# Altium schematic sheet Filter3.SchDoc
size 420 x 297 mm; SheetNumber: 8; SheetTotal: 13
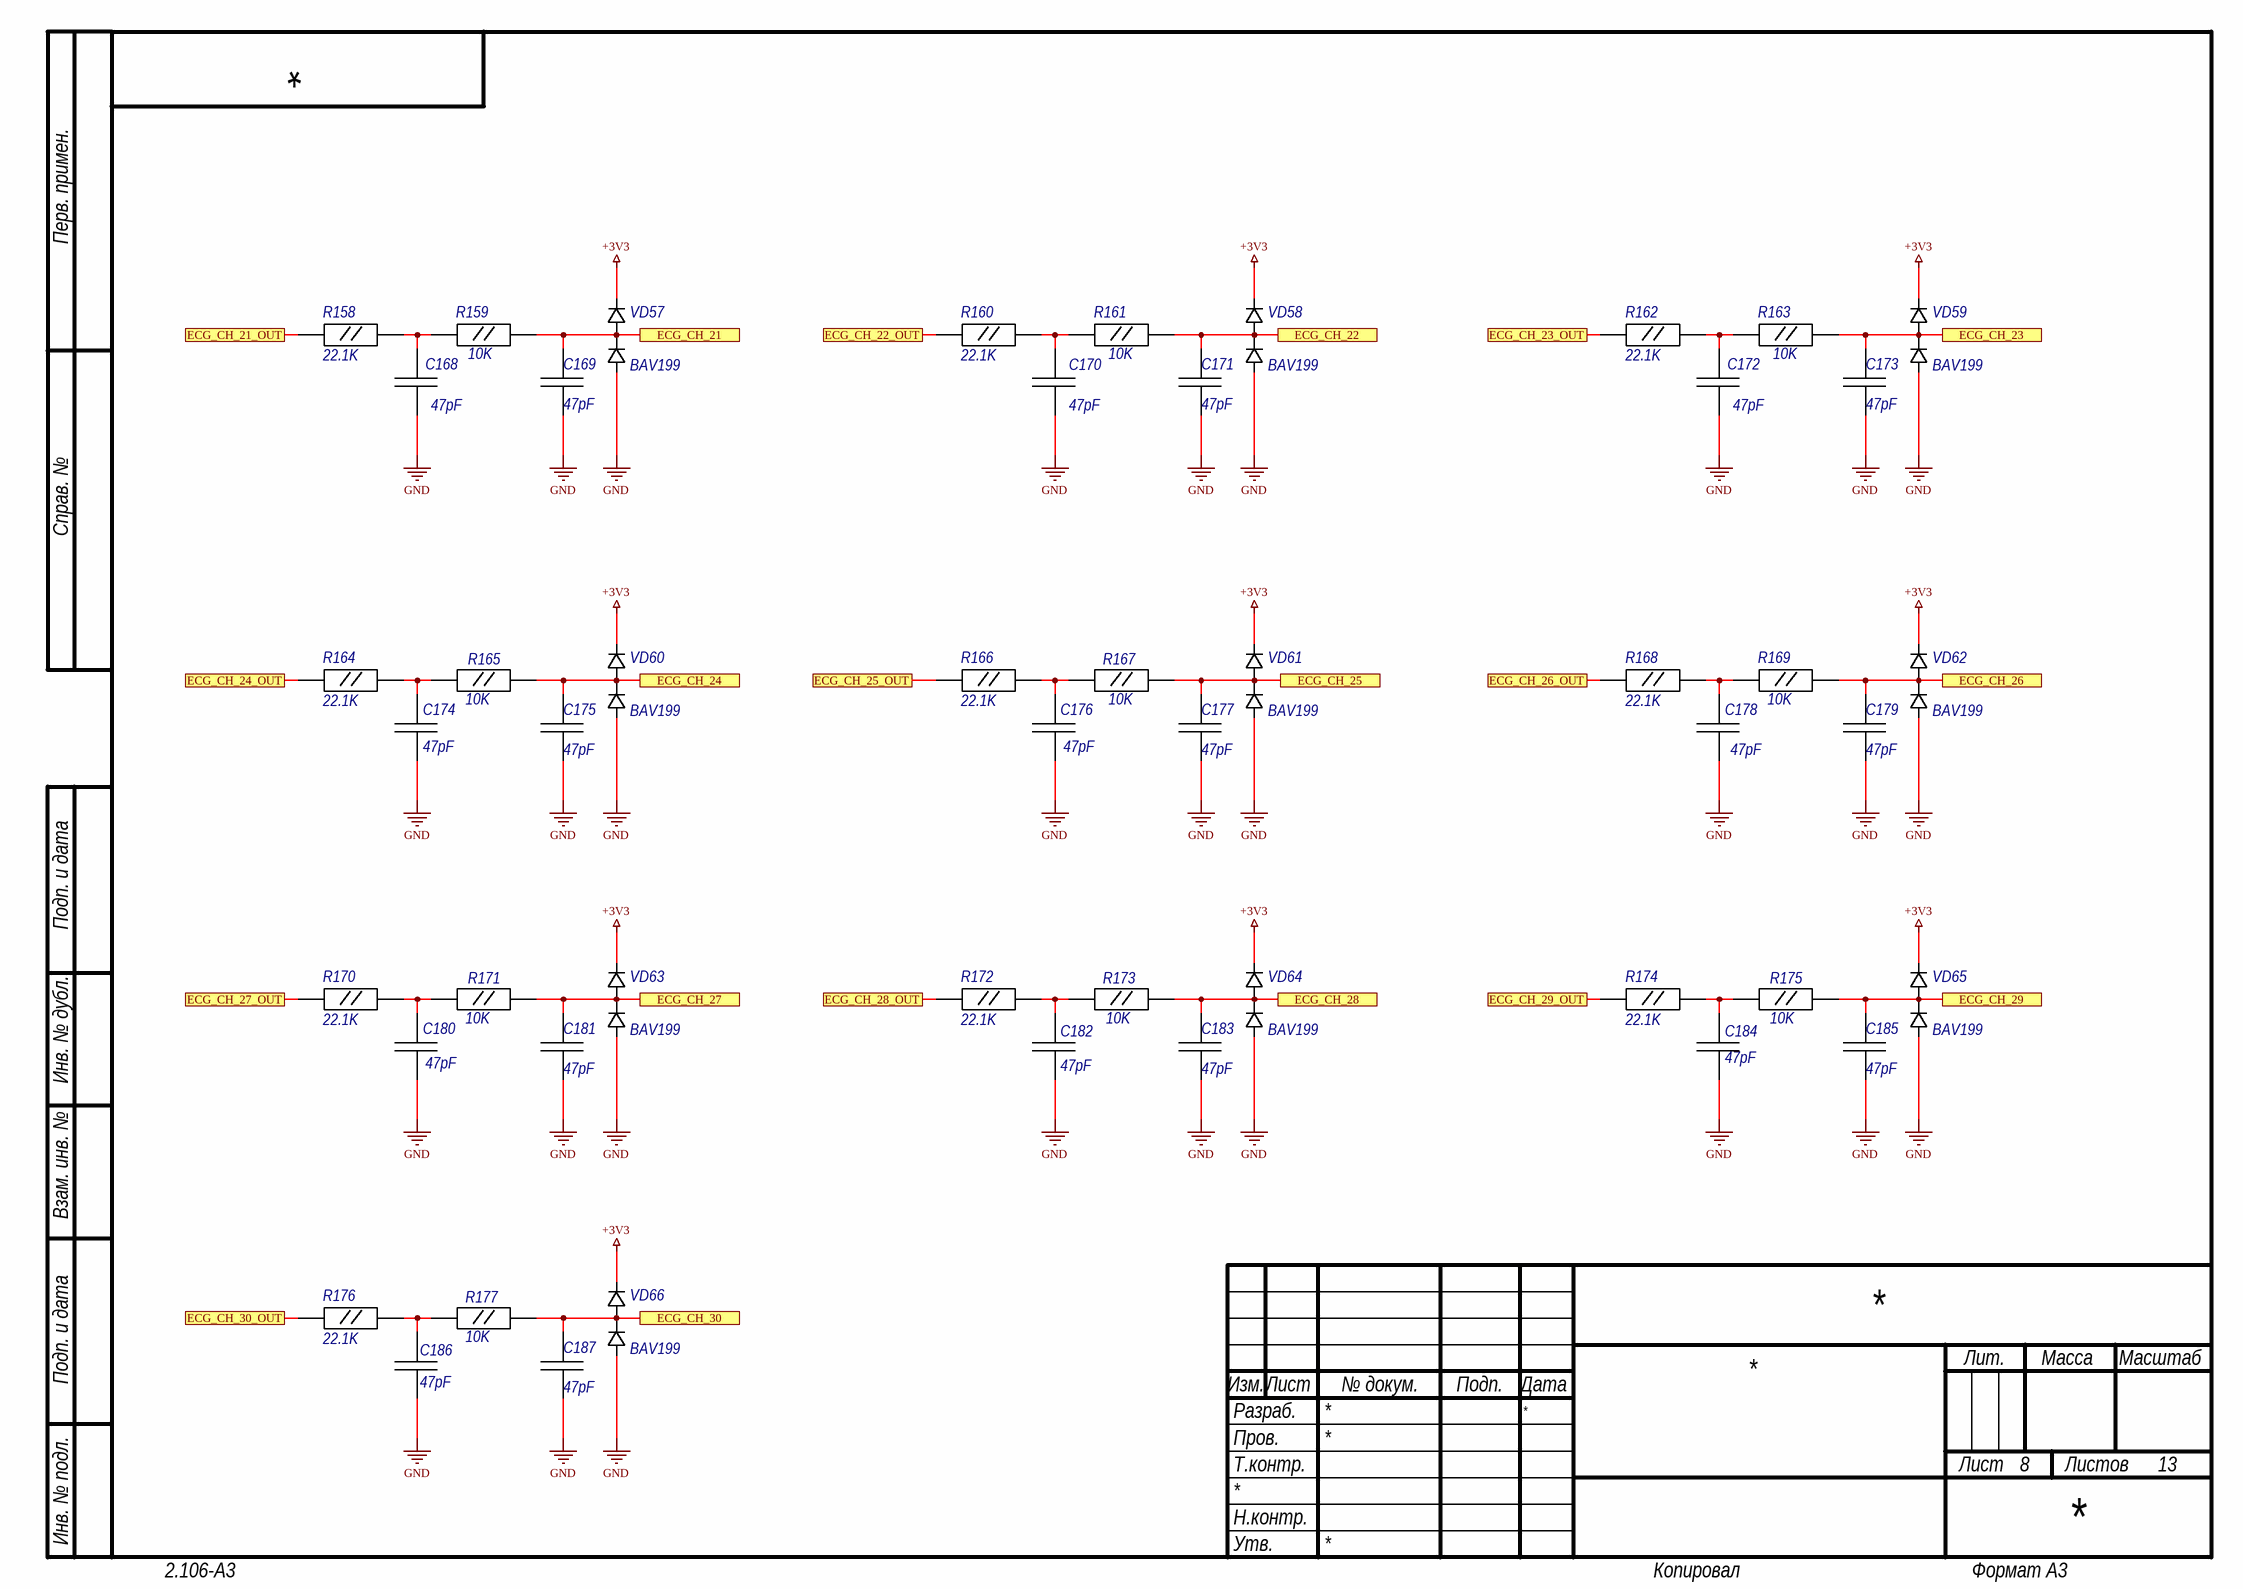
[diagram p0: Filter3.SchDoc]

## Parts
C168  47pF  [C0603]
C169  47pF  [C0603]
C170  47pF  [C0603]
C171  47pF  [C0603]
C172  47pF  [C0603]
C173  47pF  [C0603]
C174  47pF  [C0603]
C175  47pF  [C0603]
C176  47pF  [C0603]
C177  47pF  [C0603]
C178  47pF  [C0603]
C179  47pF  [C0603]
C180  47pF  [C0603]
C181  47pF  [C0603]
C182  47pF  [C0603]
C183  47pF  [C0603]
C184  47pF  [C0603]
C185  47pF  [C0603]
C186  47pF  [C0603]
C187  47pF  [C0603]
R158  22.1K  [R0603]
R159  10K  [R0603]
R160  22.1K  [R0603]
R161  10K  [R0603]
R162  22.1K  [R0603]
R163  10K  [R0603]
R164  22.1K  [R0603]
R165  10K  [R0603]
R166  22.1K  [R0603]
R167  10K  [R0603]
R168  22.1K  [R0603]
R169  10K  [R0603]
R170  22.1K  [R0603]
R171  10K  [R0603]
R172  22.1K  [R0603]
R173  10K  [R0603]
R174  22.1K  [R0603]
R175  10K  [R0603]
R176  22.1K  [R0603]
R177  10K  [R0603]
VD57  BAV199  [SOT23]
VD58  BAV199  [SOT23]
VD59  BAV199  [SOT23]
VD60  BAV199  [SOT23]
VD61  BAV199  [SOT23]
VD62  BAV199  [SOT23]
VD63  BAV199  [SOT23]
VD64  BAV199  [SOT23]
VD65  BAV199  [SOT23]
VD66  BAV199  [SOT23]

## Ports
ECG_CH_21, ECG_CH_21_OUT, ECG_CH_22, ECG_CH_22_OUT, ECG_CH_23, ECG_CH_23_OUT, ECG_CH_24, ECG_CH_24_OUT, ECG_CH_25, ECG_CH_25_OUT, ECG_CH_26, ECG_CH_26_OUT, ECG_CH_27, ECG_CH_27_OUT, ECG_CH_28, ECG_CH_28_OUT, ECG_CH_29, ECG_CH_29_OUT, ECG_CH_30, ECG_CH_30_OUT

## Nets
+3V3: VD57.2 VD58.2 VD59.2 VD60.2 VD61.2 VD62.2 VD63.2 VD64.2 VD65.2 VD66.2
GND: C168.1 C169.1 C170.1 C171.1 C172.1 C173.1 C174.1 C175.1 C176.1 C177.1 C178.1 C179.1 C180.1 C181.1 C182.1 C183.1 C184.1 C185.1 C186.1 C187.1 VD57.1 VD58.1 VD59.1 VD60.1 VD61.1 VD62.1 VD63.1 VD64.1 VD65.1 VD66.1
ECG_CH_21: C169.2 R159.2 VD57.3 ; port ECG_CH_21
ECG_CH_21_OUT: R158.1 ; port ECG_CH_21_OUT
ECG_CH_22: C171.2 R161.2 VD58.3 ; port ECG_CH_22
ECG_CH_22_OUT: R160.1 ; port ECG_CH_22_OUT
ECG_CH_23: C173.2 R163.2 VD59.3 ; port ECG_CH_23
ECG_CH_23_OUT: R162.1 ; port ECG_CH_23_OUT
ECG_CH_24: C175.2 R165.2 VD60.3 ; port ECG_CH_24
ECG_CH_24_OUT: R164.1 ; port ECG_CH_24_OUT
ECG_CH_25: C177.2 R167.2 VD61.3 ; port ECG_CH_25
ECG_CH_25_OUT: R166.1 ; port ECG_CH_25_OUT
ECG_CH_26: C179.2 R169.2 VD62.3 ; port ECG_CH_26
ECG_CH_26_OUT: R168.1 ; port ECG_CH_26_OUT
ECG_CH_27: C181.2 R171.2 VD63.3 ; port ECG_CH_27
ECG_CH_27_OUT: R170.1 ; port ECG_CH_27_OUT
ECG_CH_28: C183.2 R173.2 VD64.3 ; port ECG_CH_28
ECG_CH_28_OUT: R172.1 ; port ECG_CH_28_OUT
ECG_CH_29: C185.2 R175.2 VD65.3 ; port ECG_CH_29
ECG_CH_29_OUT: R174.1 ; port ECG_CH_29_OUT
ECG_CH_30: C187.2 R177.2 VD66.3 ; port ECG_CH_30
ECG_CH_30_OUT: R176.1 ; port ECG_CH_30_OUT
NetC168_2: C168.2 R158.2 R159.1
NetC170_2: C170.2 R160.2 R161.1
NetC172_2: C172.2 R162.2 R163.1
NetC174_2: C174.2 R164.2 R165.1
NetC176_2: C176.2 R166.2 R167.1
NetC178_2: C178.2 R168.2 R169.1
NetC180_2: C180.2 R170.2 R171.1
NetC182_2: C182.2 R172.2 R173.1
NetC184_2: C184.2 R174.2 R175.1
NetC186_2: C186.2 R176.2 R177.1

## Notes on the sheet
- Перв. примен.
- Справ. №
- Подп. и дата
- Инв. № дубл.
- Взам. инв. №
- Разраб.
- Изм.
- Лист
- № докум.
- Подп.
- Дата
- Лит.
- Масса
- Масштаб
- Пров.
- Т.контр.
- Листов
- Инв. № подл.
- Утв.
- Н.контр.
- 2.106-A3
- Копировал
- Формат А3

## Library data of the parts
C168-C187 = CC_SMD_0603: Ceramic Capacitor SMD; Package: 0603; Value: 47pF
R158-R177 = R0603: Resistor SMD
  R158 R160 R162 R164 R166 R168 R170 R172 R174 R176: Value: 22.1K
  R159 R161 R163 R165 R167 R169 R171 R173 R175 R177: Value: 10K
VD57-VD66 = DIODE_BAV199: Diod Schottky; Diode Type: Standard; Package: SOT-23; PartNumber: BAV199; Manufacturer Part Number 1: BAV199